# EAGLE design LIC_rack_CV-01 (EAGLE 7.2.0)
AUTHOR: M. Petrilak; VERSION: 00

## Sheet 1 of 3
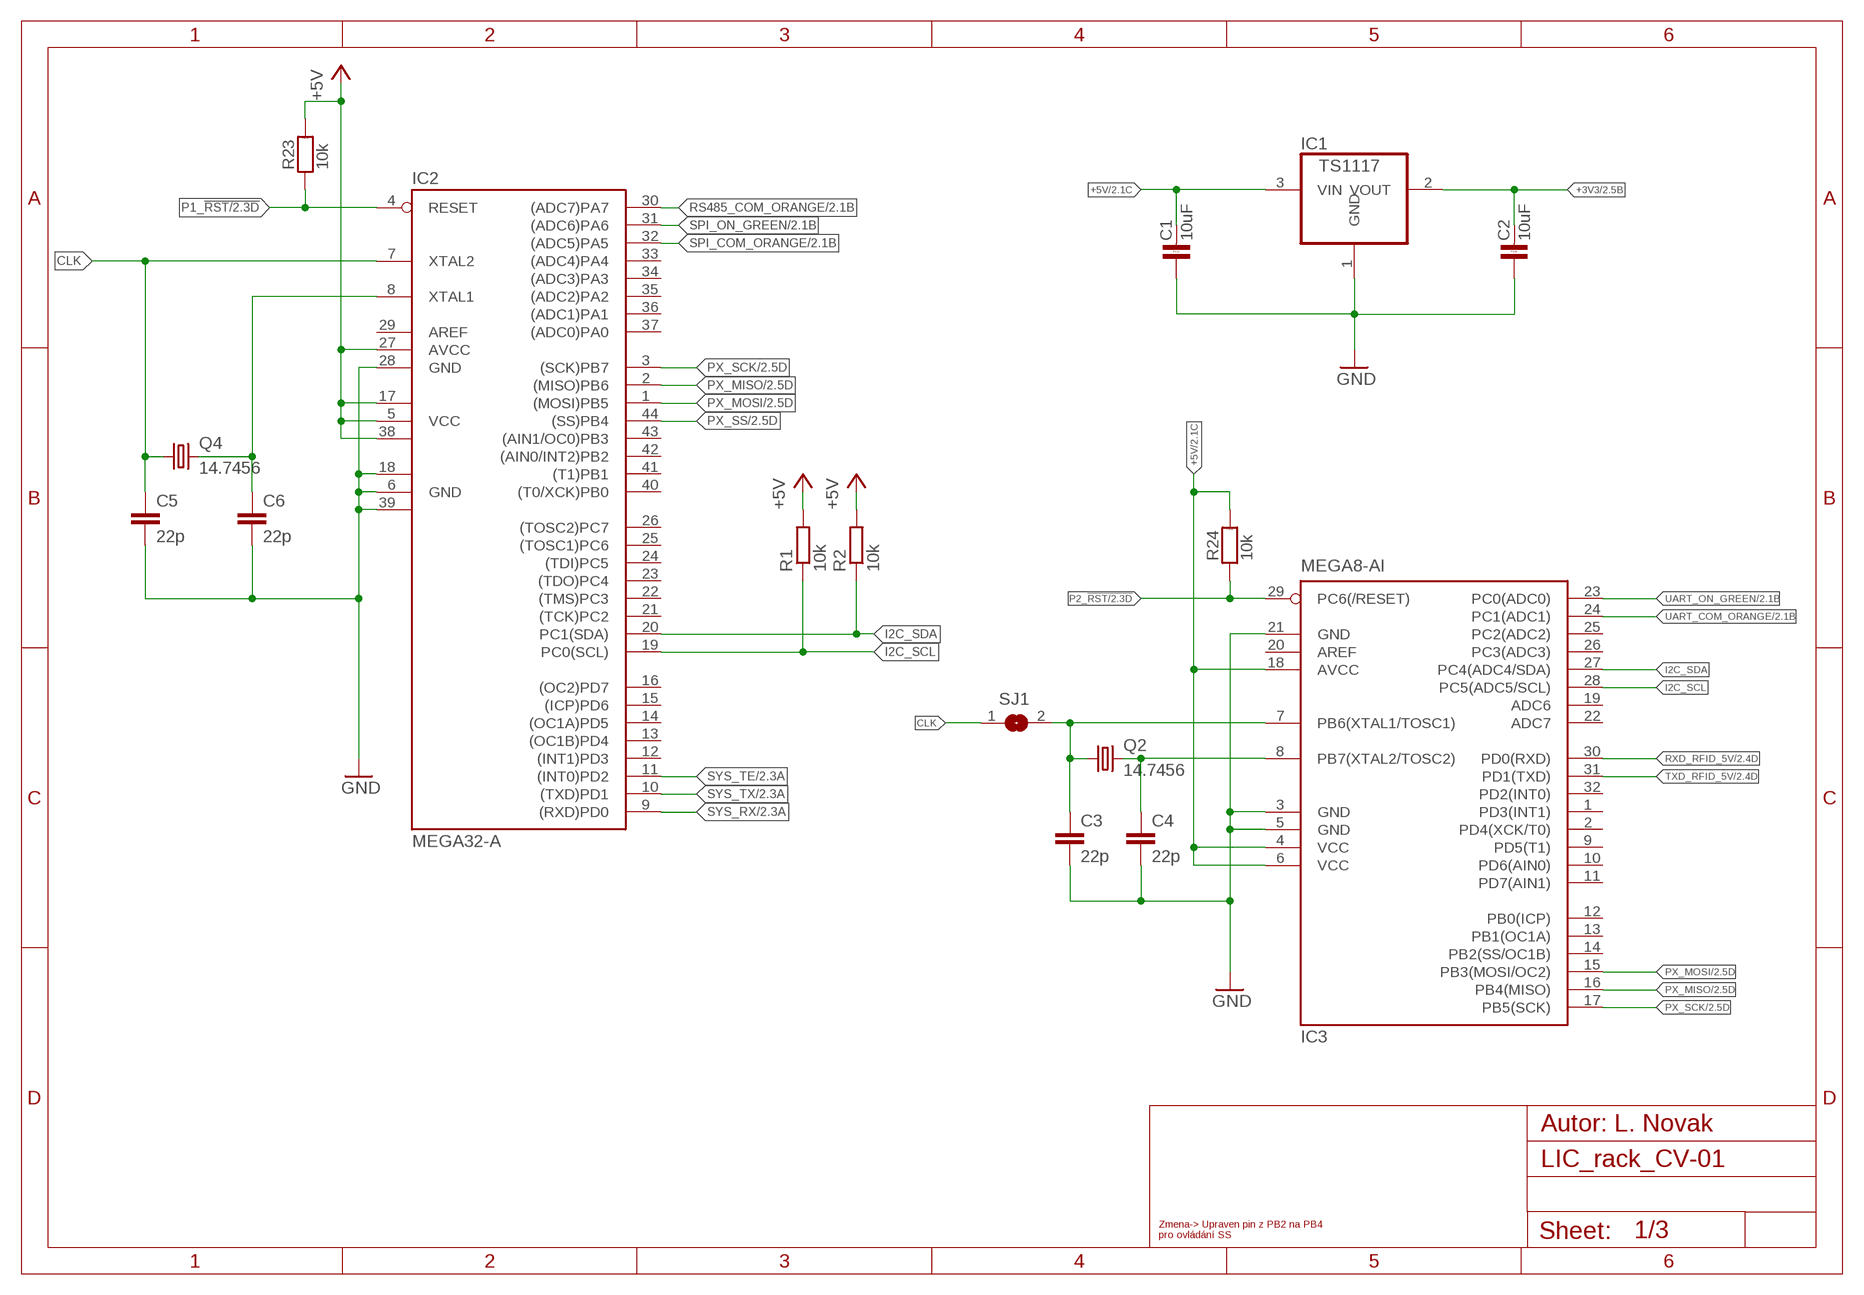
[diagram p0: schematic, sheet 1]

### Parts
C1  10uF  C-KER_1206  [1206]
C2  10uF  C-KER_1206  [1206]
C3  22p  C-EUC0805  [C0805]
C4  22p  C-EUC0805  [C0805]
C5  22p  C-EUC0805  [C0805]
C6  22p  C-EUC0805  [C0805]
IC1  TS1117  REG1117  [SOT223]
IC2  MEGA32-A  [TQFP44]
IC3  MEGA8-AI  [TQFP32-08]
Q2  14.7456  XTAL  [HC49U70]
Q4  14.7456  XTAL  [HC49U70]
R1  10k  R-EU_R1206  [R1206]
R2  10k  R-EU_R1206  [R1206]
R23  10k  R_1206  [1206]
R24  10k  R_1206  [1206]
SJ1  SJ  [SJ]

### Nets
+3V3: C2.2 IC1.2(VOUT) ; also sheet 2,3
+5V: C1.2 IC1.3(VIN) IC2.5(VCC) IC2.17(VCC1) IC2.27(AVCC) IC2.38(VCC2) IC3.4(VCC) IC3.6(VCC) IC3.18(AVCC) R1.2 R2.2 R23.2 R24.2 ; also sheet 2,3
CLK: C5.1 IC2.7(XTAL2) Q4.1 SJ1.1
CLK1: C3.1 IC3.7(PB6(XTAL1/TOSC1)) Q2.1 SJ1.2
GND: C1.1 C2.1 C3.2 C4.2 C5.2 C6.2 IC1.1(GND) IC2.6(GND) IC2.18(GND1) IC2.28(GND) IC2.39(GND2) IC3.3(GND) IC3.5(GND) IC3.21(GND) ; also sheet 2
I2C_SCL: IC2.19(PC0(SCL)) IC3.28(PC5(ADC5/SCL)) R1.1
I2C_SDA: IC2.20(PC1(SDA)) IC3.27(PC4(ADC4/SDA)) R2.1
N$3: C4.1 IC3.8(PB7(XTAL2/TOSC2)) Q2.2
N$19: C6.1 IC2.8(XTAL1) Q4.2
P1_!RST: IC2.4(RESET) R23.1 ; also sheet 2
P2_!RST: IC3.29(PC6(/RESET)) R24.1 ; also sheet 2
PX_MISO: IC2.2((MISO)PB6) IC3.16(PB4(MISO)) ; also sheet 2,3
PX_MOSI: IC2.1((MOSI)PB5) IC3.15(PB3(MOSI/OC2)) ; also sheet 2,3
PX_SCK: IC2.3((SCK)PB7) IC3.17(PB5(SCK)) ; also sheet 2,3
PX_SS: IC2.44((SS)PB4) ; also sheet 2,3
RS485_COM_ORANGE: IC2.30((ADC7)PA7) ; also sheet 2
RXD_RFID_5V: IC3.30(PD0(RXD)) ; also sheet 2,3
SPI_COM_ORANGE: IC2.32((ADC5)PA5) ; also sheet 2
SPI_ON_GREEN: IC2.31((ADC6)PA6) ; also sheet 2
SYS_RX: IC2.9((RXD)PD0) ; also sheet 2
SYS_TE: IC2.11((INT0)PD2) ; also sheet 2
SYS_TX: IC2.10((TXD)PD1) ; also sheet 2
TXD_RFID_5V: IC3.31(PD1(TXD)) ; also sheet 2,3
UART_COM_ORANGE: IC3.24(PC1(ADC1)) ; also sheet 2
UART_ON_GREEN: IC3.23(PC0(ADC0)) ; also sheet 2
Unconnected: IC2.12((INT1)PD3) IC2.13((OC1B)PD4) IC2.14((OC1A)PD5) IC2.15((ICP)PD6) IC2.16((OC2)PD7) IC2.21((TCK)PC2) IC2.22((TMS)PC3) IC2.23((TDO)PC4) IC2.24((TDI)PC5) IC2.25((TOSC1)PC6) IC2.26((TOSC2)PC7) IC2.29(AREF) IC2.33((ADC4)PA4) IC2.34((ADC3)PA3) IC2.35((ADC2)PA2) IC2.36((ADC1)PA1) IC2.37((ADC0)PA0) IC2.40((T0/XCK)PB0) IC2.41((T1)PB1) IC2.42((AIN0/INT2)PB2) IC2.43((AIN1/OC0)PB3) IC3.1(PD3(INT1)) IC3.2(PD4(XCK/T0)) IC3.9(PD5(T1)) IC3.10(PD6(AIN0)) IC3.11(PD7(AIN1)) IC3.12(PB0(ICP)) IC3.13(PB1(OC1A)) IC3.14(PB2(SS/OC1B)) IC3.19(ADC6) IC3.20(AREF) IC3.22(ADC7) IC3.25(PC2(ADC2)) IC3.26(PC3(ADC3)) IC3.32(PD2(INT0))

### Notes on the sheet
- Zmena-> Upraven pin z PB2 na PB4
  pro ovládání SS

## Sheet 2 of 3
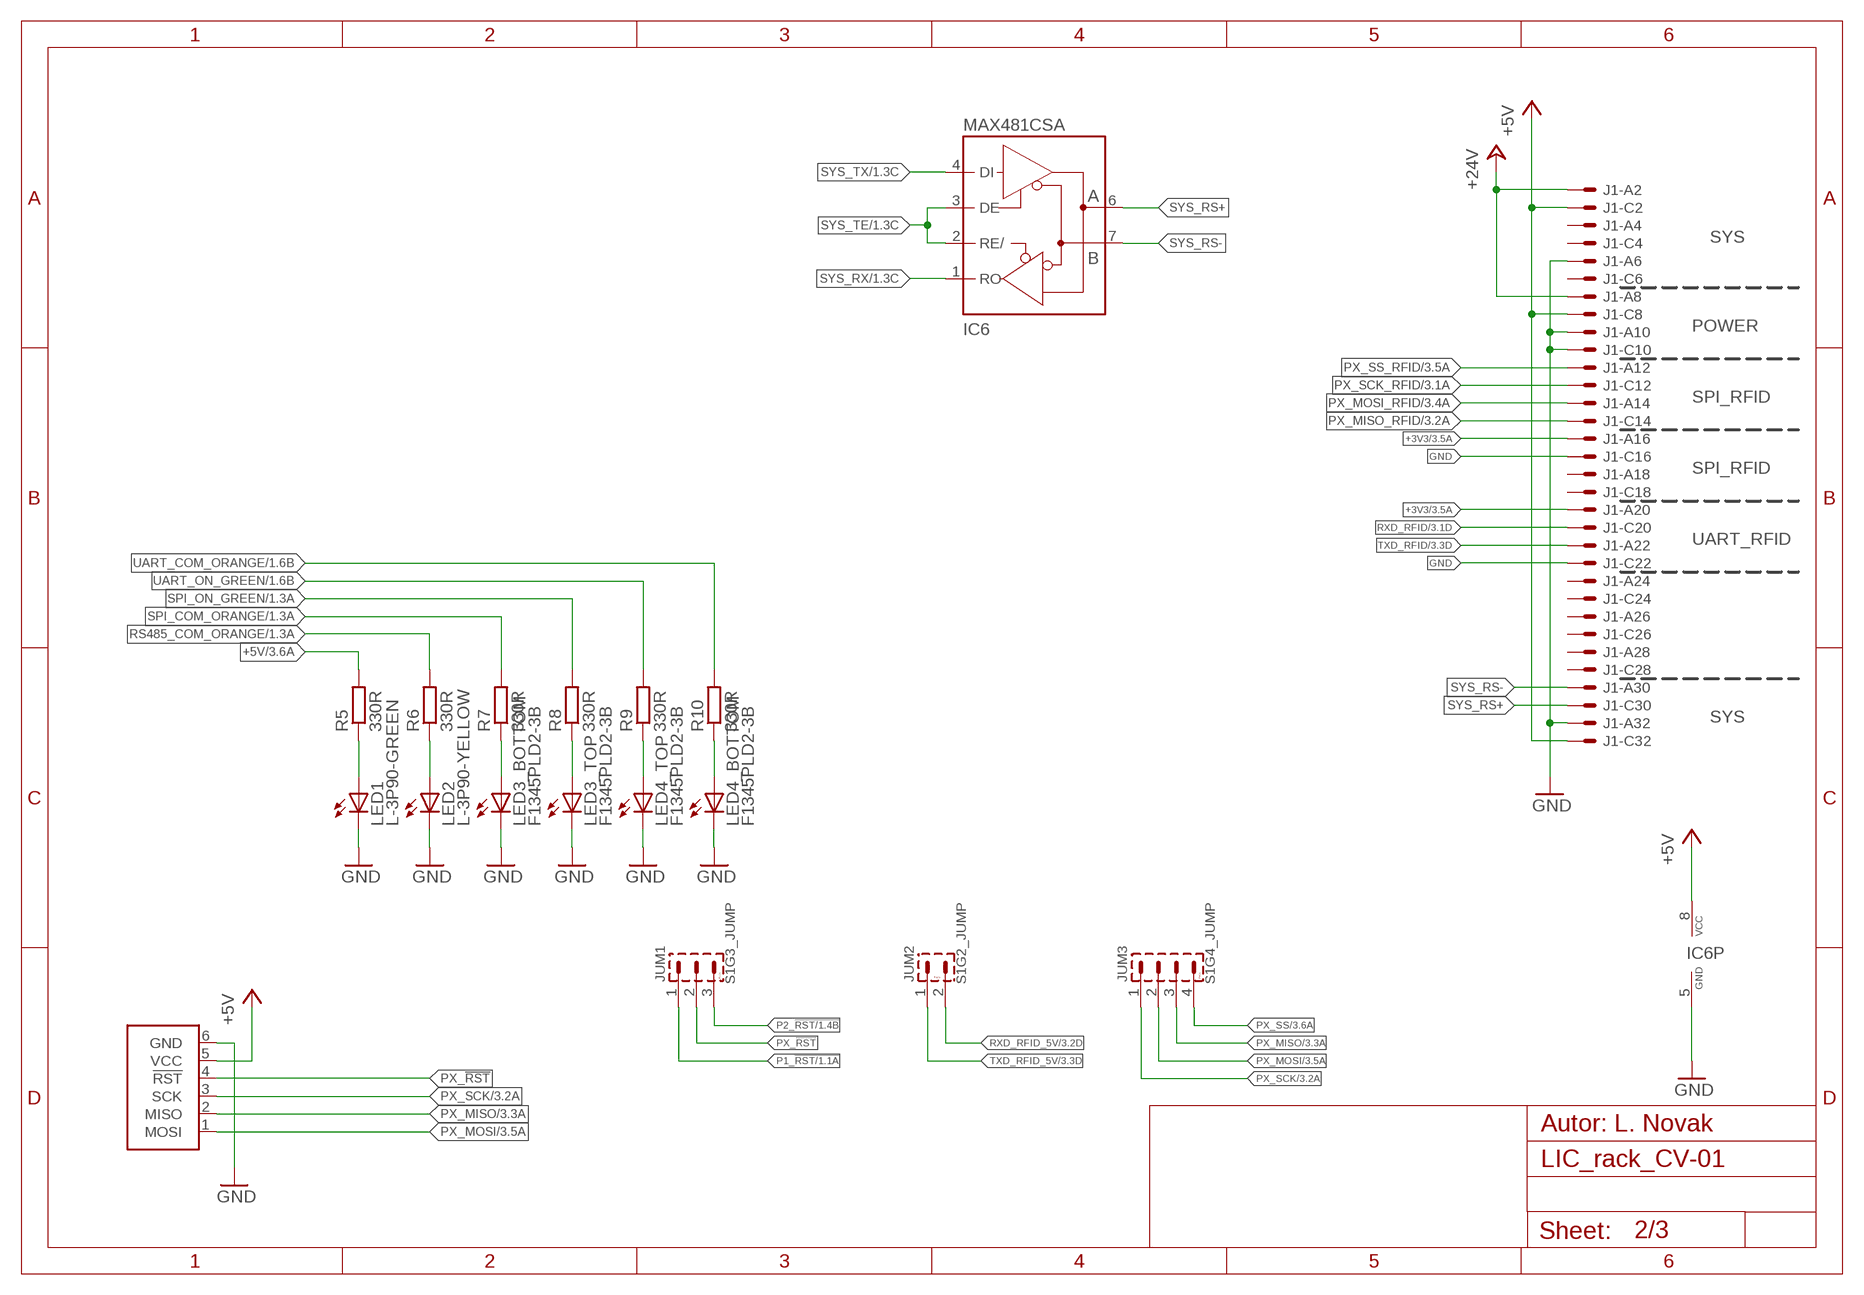
[diagram p1: schematic, sheet 2]

### Parts
IC6  MAX481CSA  [SO08]
J1  VG32SP  [VG32P]
JUM1  S1G3_JUMP  [S1G3_JUM]
JUM2  S1G2_JUMP  [S1G2_JUM]
JUM3  S1G4_JUMP  [S1G4_JUM]
LED1  L-3P90-GREEN  [L-3P90]
LED2  L-3P90-YELLOW  [L-3P90]
LED3  F1345PLD2-3B  [F1345PLD2-3B]
LED4  F1345PLD2-3B  [F1345PLD2-3B]
R5  330R  R-EU_R1206  [R1206]
R6  330R  R-EU_R1206  [R1206]
R7  330R  R-EU_R1206  [R1206]
R8  330R  R-EU_R1206  [R1206]
R9  330R  R-EU_R1206  [R1206]
R10  330R  R-EU_R1206  [R1206]
U1  ATPROG-V  [6410-06]

### Nets
+3V3: J1.A16 J1.A20 ; also sheet 1,3
+5V: IC6.8(VCC) J1.C2 J1.C8 J1.C32 R5.2 U1.5(VCC) ; also sheet 1,3
+24V: J1.A2 J1.A8
GND: IC6.5(GND) J1.A6 J1.A10 J1.A32 J1.C10 J1.C16 J1.C22 LED1.K(C) LED2.K(C) LED3.1K(C) LED3.2K(C) LED4.1K(C) LED4.2K(C) U1.6(GND) ; also sheet 1
N$1: LED2.A R6.1
N$2: LED1.A R5.1
N$9: LED4.1A(A) R10.1
N$10: LED4.2A(A) R9.1
N$11: LED3.2A(A) R8.1
N$12: LED3.1A(A) R7.1
P1_!RST: JUM1.1 ; also sheet 1
P2_!RST: JUM1.3 ; also sheet 1
PX_!RST: JUM1.2 U1.4(!RST)
PX_MISO: JUM3.3 U1.2(MISO) ; also sheet 1,3
PX_MISO_RFID: J1.C14 ; also sheet 3
PX_MOSI: JUM3.2 U1.1(MOSI) ; also sheet 1,3
PX_MOSI_RFID: J1.A14 ; also sheet 3
PX_SCK: JUM3.1 U1.3(SCK) ; also sheet 1,3
PX_SCK_RFID: J1.C12 ; also sheet 3
PX_SS: JUM3.4 ; also sheet 1,3
PX_SS_RFID: J1.A12 ; also sheet 3
RS485_COM_ORANGE: R6.2 ; also sheet 1
RXD_RFID: J1.C20 ; also sheet 3
RXD_RFID_5V: JUM2.2 ; also sheet 1,3
SPI_COM_ORANGE: R7.2 ; also sheet 1
SPI_ON_GREEN: R8.2 ; also sheet 1
SYS_RS+: IC6.6(A) J1.C30
SYS_RS-: IC6.7(B) J1.A30
SYS_RX: IC6.1(RO) ; also sheet 1
SYS_TE: IC6.2(RE/) IC6.3(DE) ; also sheet 1
SYS_TX: IC6.4(DI) ; also sheet 1
TXD_RFID: J1.A22 ; also sheet 3
TXD_RFID_5V: JUM2.1 ; also sheet 1,3
UART_COM_ORANGE: R10.2 ; also sheet 1
UART_ON_GREEN: R9.2 ; also sheet 1
Unconnected: J1.A4 J1.A18 J1.A24 J1.A26 J1.A28 J1.C4 J1.C6 J1.C18 J1.C24 J1.C26 J1.C28

### Notes on the sheet
- SYS
- POWER
- SPI_RFID
- SPI_RFID
- UART_RFID
- SYS

## Sheet 3 of 3
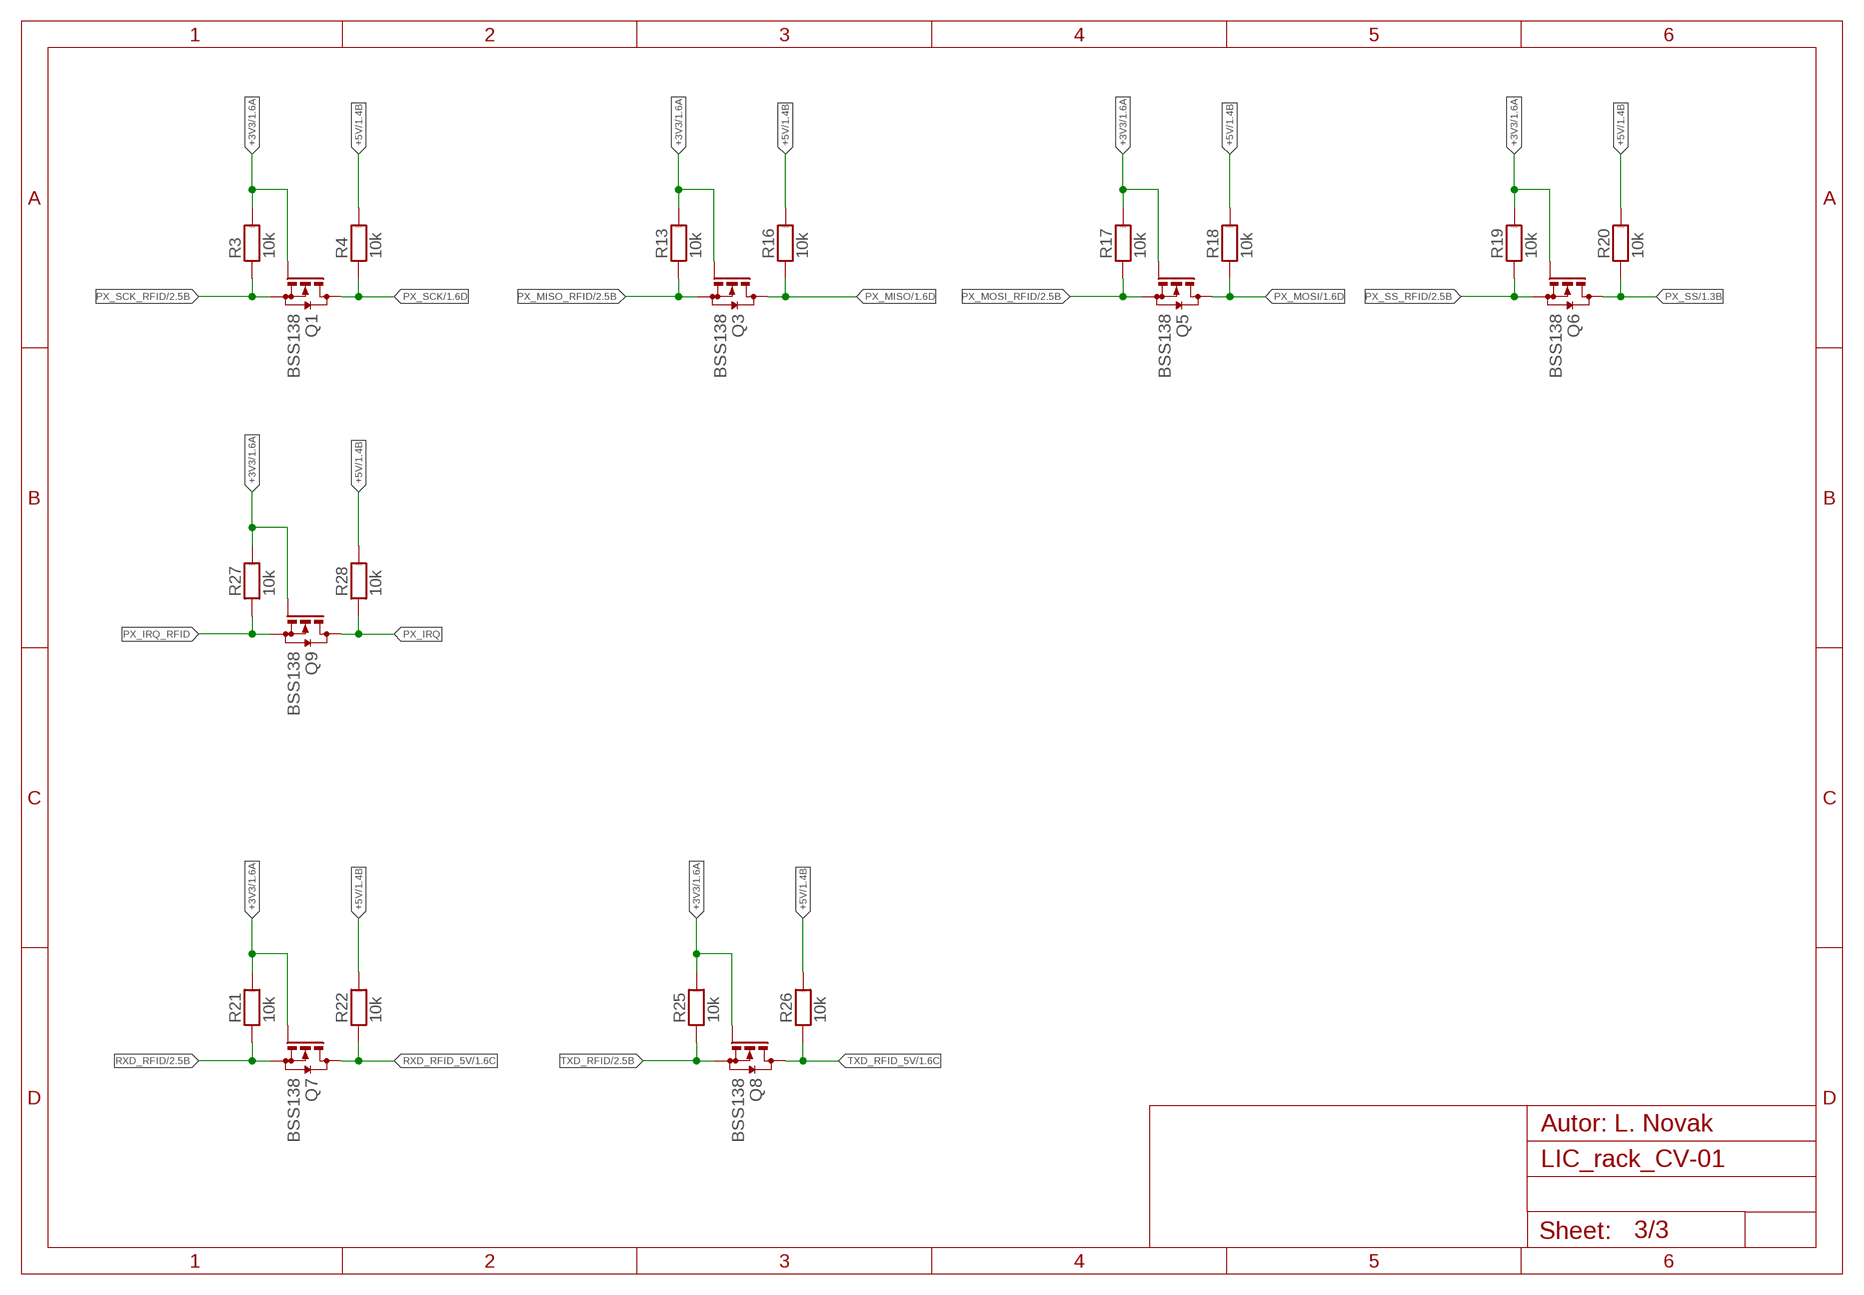
[diagram p2: schematic, sheet 3]

### Parts
Q1  BSS138  BSS123  [SOT23]
Q3  BSS138  BSS123  [SOT23]
Q5  BSS138  BSS123  [SOT23]
Q6  BSS138  BSS123  [SOT23]
Q7  BSS138  BSS123  [SOT23]
Q8  BSS138  BSS123  [SOT23]
Q9  BSS138  BSS123  [SOT23]
R3  10k  R_1206  [1206]
R4  10k  R_1206  [1206]
R13  10k  R_1206  [1206]
R16  10k  R_1206  [1206]
R17  10k  R_1206  [1206]
R18  10k  R_1206  [1206]
R19  10k  R_1206  [1206]
R20  10k  R_1206  [1206]
R21  10k  R_1206  [1206]
R22  10k  R_1206  [1206]
R25  10k  R_1206  [1206]
R26  10k  R_1206  [1206]
R27  10k  R_1206  [1206]
R28  10k  R_1206  [1206]

### Nets
+3V3: Q1.1(G) Q3.1(G) Q5.1(G) Q6.1(G) Q7.1(G) Q8.1(G) Q9.1(G) R3.2 R13.2 R17.2 R19.2 R21.2 R25.2 R27.2 ; also sheet 1,2
+5V: R4.2 R16.2 R18.2 R20.2 R22.2 R26.2 R28.2 ; also sheet 1,2
PX_IRQ: Q9.3(D) R28.1
PX_IRQ_RFID: Q9.2(S) R27.1
PX_MISO: Q3.3(D) R16.1 ; also sheet 1,2
PX_MISO_RFID: Q3.2(S) R13.1 ; also sheet 2
PX_MOSI: Q5.3(D) R18.1 ; also sheet 1,2
PX_MOSI_RFID: Q5.2(S) R17.1 ; also sheet 2
PX_SCK: Q1.3(D) R4.1 ; also sheet 1,2
PX_SCK_RFID: Q1.2(S) R3.1 ; also sheet 2
PX_SS: Q6.3(D) R20.1 ; also sheet 1,2
PX_SS_RFID: Q6.2(S) R19.1 ; also sheet 2
RXD_RFID: Q7.2(S) R21.1 ; also sheet 2
RXD_RFID_5V: Q7.3(D) R22.1 ; also sheet 1,2
TXD_RFID: Q8.2(S) R25.1 ; also sheet 2
TXD_RFID_5V: Q8.3(D) R26.1 ; also sheet 1,2

## Library data of the parts
C1 C2 = #PaJa_31:C-KER: Kondenzator - keramicky
C3-C6 = rcl:C-EU: CAPACITOR, European symbol
IC1 = burr-brown:REG1117: 800mA and 1A Low Dropout (LDO) Positive Regulator 1.8V, 2.5V, 2.85V, 3.3V, 5V, and Adj; MPN: REG1117; OC_FARNELL: 1097566; OC_NEWARK: 14P6981
IC2 = atmel:MEGA32: MICROCONTROLLER 32 Kbytes FLASH 2 Kbytes SRAM 1 Kbytes EEPROM USART 8-channel 10 bit ADC Source: www.atmel.com .. doc2503.pdf; MPN: ATMEGA32-16AU; OC_FARNELL: 9171274; OC_NEWARK: 69K6677
IC3 = atmel:MEGA8: MICROCONTROLLER 8 Kbytes FLASH, 1 kbytes SRAM, 512 bytes EEPROM, USART, 6-channel 10 bit ADC, 2-channel 8 bit ADC Pin compatible with Atmega48, ATMega88, ATMega168 Source: avr.lbr; MPN: ATMEGA8-16AU; OC_FARNELL: 9171371; OC_NEWARK: 73M8863
IC6 = maxim:MAX481CSA: RS485 TRANSEIVER
J1 = 19inch:VG32S: PCB EUROCARD, 32-pin type C/AC, 5.08 mm
JUM1 = #PaJa_konektory:S1G3_JUMP: Radove konektory - koliky - 3x
JUM2 = #PaJa_konektory:S1G2_JUMP: Radove konektory - koliky - 2x
JUM3 = #PaJa_konektory:S1G4_JUMP: Radove konektory - koliky - 4x
LED1 LED2 = led:L-3P90
LED3 LED4 = led:F1345PLD2-3B
Q1 Q3 Q5-Q9 = transistor-small-signal:BSS123: N-CHANNEL MOS FET
Q2 Q4 = crystal:XTAL
R1 R2 R5-R10 = rcl:R-EU_: RESISTOR, European symbol
R3 R4 R13 R16-R28 = #PaJa_31:R: Rezistor
SJ1 = jumper:SJ: SMD solder JUMPER
U1 = con-molex:ATPROG

## Board
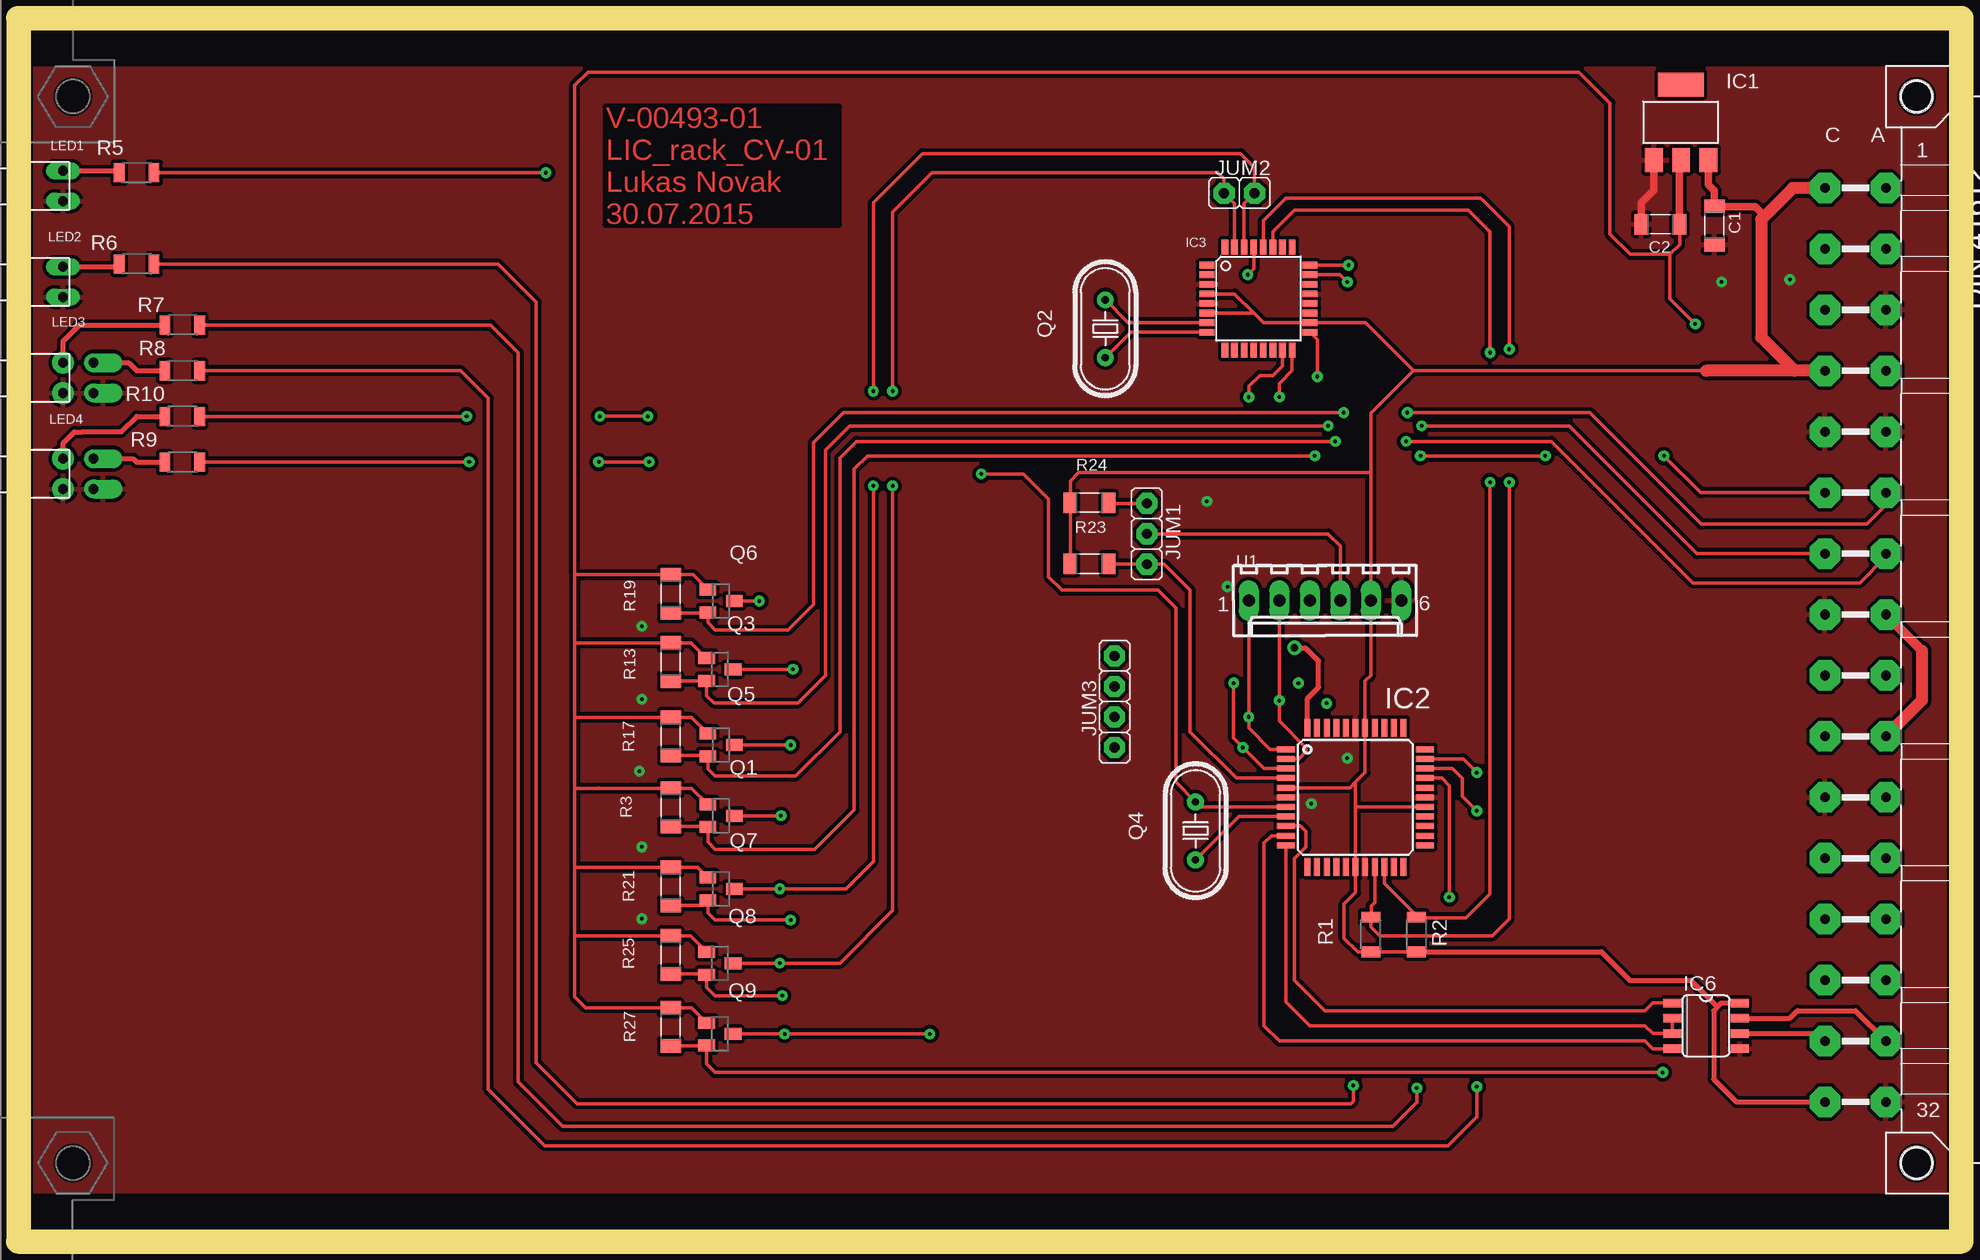
[diagram p3: board, top side]
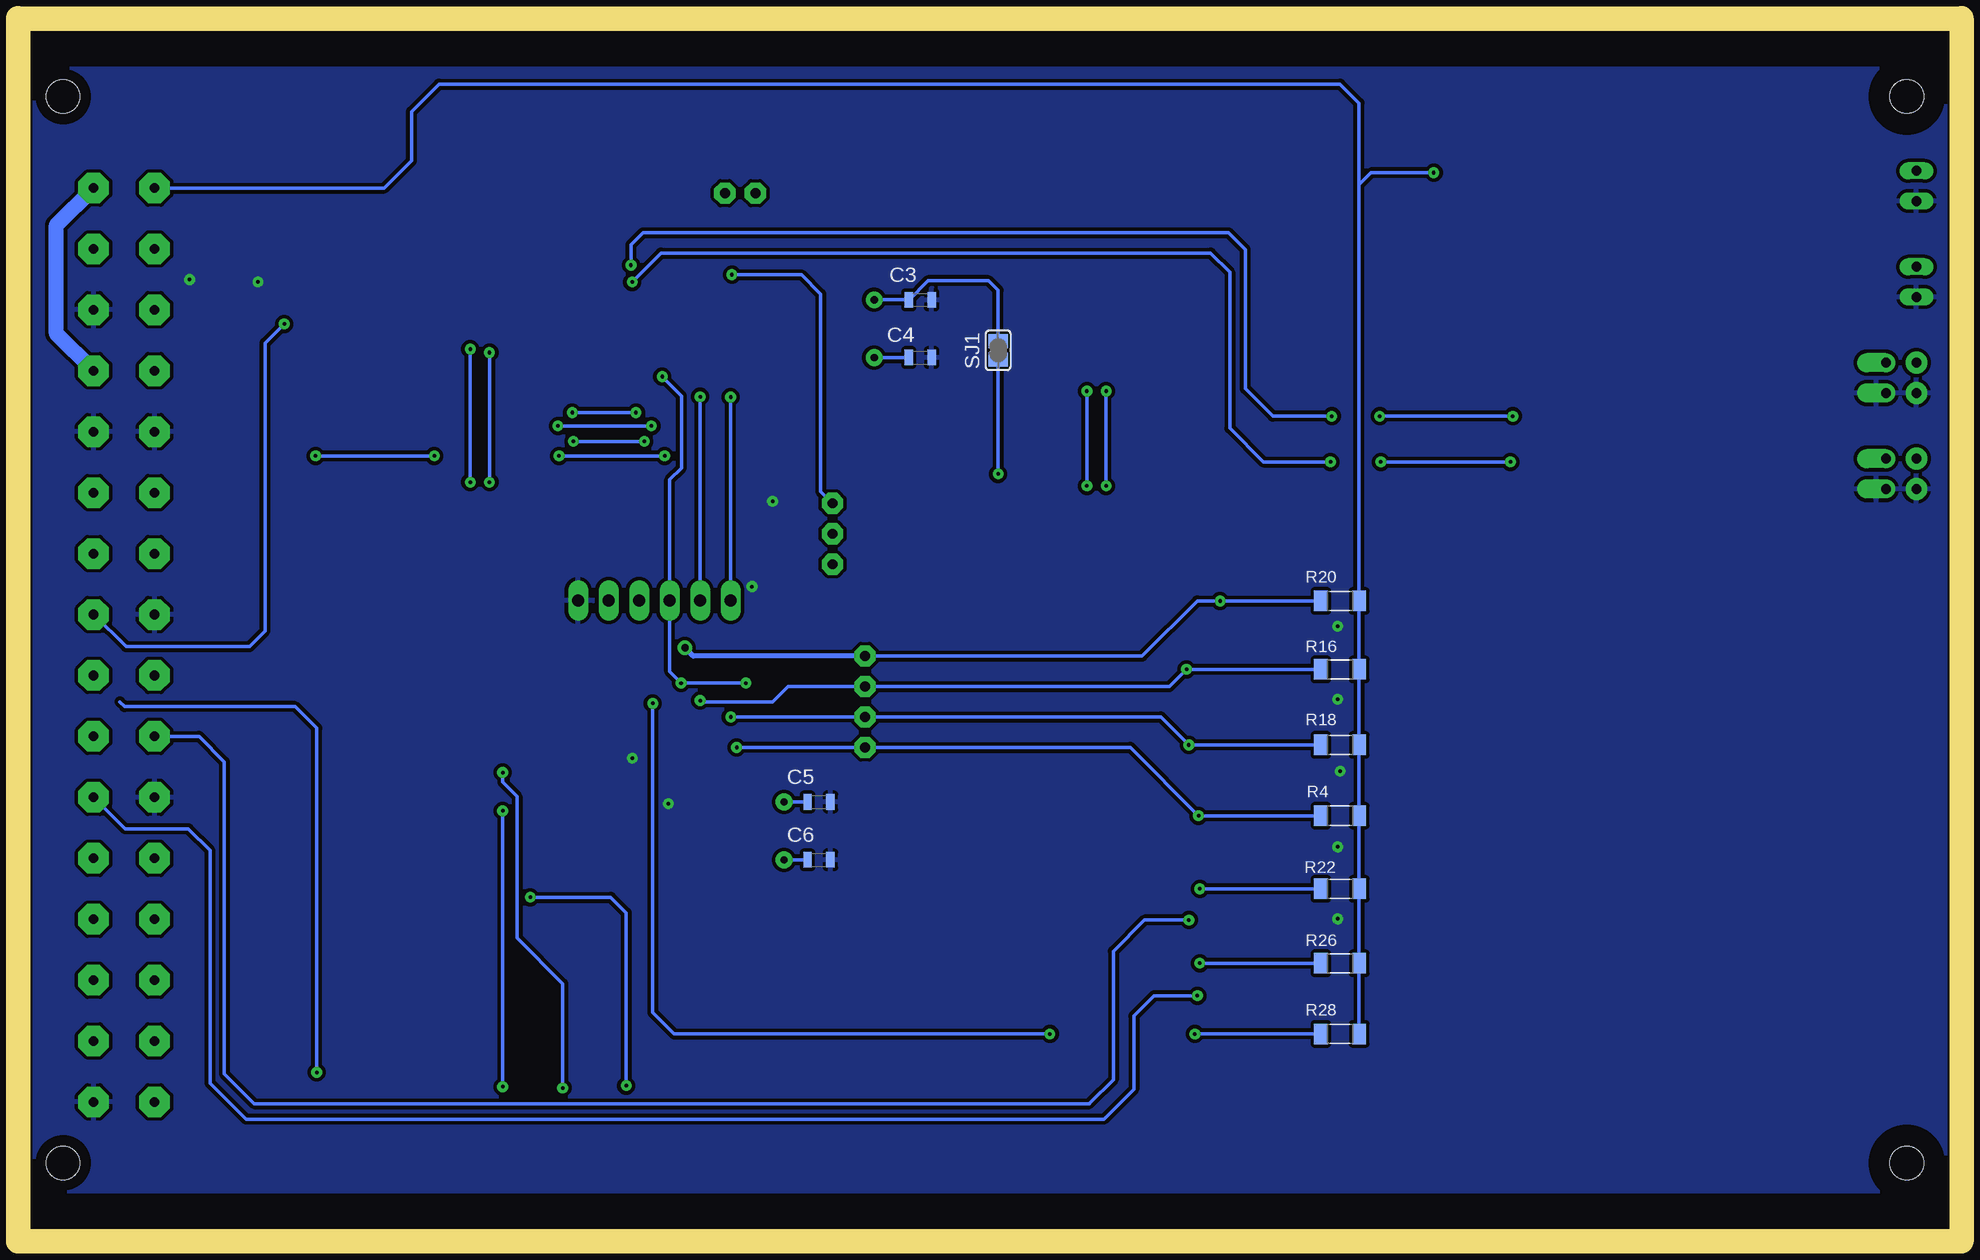
[diagram p4: board, bottom side, seen from below]

Size 160 x 100 mm. Coordinates in mm from the lower left corner, seen from the top.
Copper layers (1*16): Top 0.04mm / dielectric 1.5mm / Bottom 0.04mm
Design rules "mucha_navrh_my_fine *": minimum track width 0.2mm, minimum drill 0.3mm, track to track 0.3mm, track to pad 0.3mm, pad to pad 0.3mm, via to via 0.3mm, smd to smd 0mil, copper to edge 0.2mm, drill to drill 0.2mm, minimum pad ring 0.3mm, minimum via ring 0.3mm, stop-mask expansion 0.1mm, vias tented up to drill 0.5mm, thermal gap 0.3mm

### Footprints (pad centres in the part's own frame; a part is rotated, then mirrored left to right if it is on the bottom)
1206 = smd 1.143 x 1.702: 1 -1.587,0; 2 1.587,0
C0805 = smd 0.7 x 1.3: 1 -0.95,0; 2 0.95,0
SOT223 = smd 1.499 x 2.007: 1 -2.261,-3.15; 2 0.025,-3.15; 3 2.311,-3.15 | smd 3.81 x 2.007: 4 0,3.15
TQFP44 = smd 1.5 x 0.5: 1 -5.8,4; 2 -5.8,3.2; 3 -5.8,2.4; 4 -5.8,1.6; 5 -5.8,0.8; 6 -5.8,0; 7 -5.8,-0.8; 8 -5.8,-1.6; 9 -5.8,-2.4; 10 -5.8,-3.2; 11 -5.8,-4; 23 5.8,-4; 24 5.8,-3.2; 25 5.8,-2.4; 26 5.8,-1.6; 27 5.8,-0.8; 28 5.8,0; 29 5.8,0.8; 30 5.8,1.6; 31 5.8,2.4; 32 5.8,3.2; 33 5.8,4 | smd 0.5 x 1.5: 12 -4,-5.8; 13 -3.2,-5.8; 14 -2.4,-5.8; 15 -1.6,-5.8; 16 -0.8,-5.8; 17 0,-5.8; 18 0.8,-5.8; 19 1.6,-5.8; 20 2.4,-5.8; 21 3.2,-5.8; 22 4,-5.8; 34 4,5.8; 35 3.2,5.8; 36 2.4,5.8; 37 1.6,5.8; 38 0.8,5.8; 39 0,5.8; 40 -0.8,5.8; 41 -1.6,5.8; 42 -2.4,5.8; 43 -3.2,5.8; 44 -4,5.8
TQFP32-08 = smd 1.27 x 0.559: 1 -4.293,2.8; 2 -4.293,2; 3 -4.293,1.2; 4 -4.293,0.4; 5 -4.293,-0.4; 6 -4.293,-1.2; 7 -4.293,-2; 8 -4.293,-2.8; 17 4.293,-2.8; 18 4.293,-2; 19 4.293,-1.2; 20 4.293,-0.4; 21 4.293,0.4; 22 4.293,1.2; 23 4.293,2; 24 4.293,2.8 | smd 0.559 x 1.27: 9 -2.8,-4.293; 10 -2,-4.293; 11 -1.2,-4.293; 12 -0.4,-4.293; 13 0.4,-4.293; 14 1.2,-4.293; 15 2,-4.293; 16 2.8,-4.293; 25 2.8,4.293; 26 2,4.293; 27 1.2,4.293; 28 0.4,4.293; 29 -0.4,4.293; 30 -1.2,4.293; 31 -2,4.293; 32 -2.8,4.293
SO08 = smd 0.72 x 1.5: 1 -1.905,-2.8; 2 -0.635,-2.8; 3 0.635,-2.8; 4 1.905,-2.8; 5 1.905,2.8; 6 0.635,2.8; 7 -0.635,2.8; 8 -1.905,2.8
VG32P = drill 0.8 pad 2.54 octagon: A2 154.7,36.83; A4 154.7,31.75; A6 154.7,26.67; A8 154.7,21.59; A10 154.7,16.51; A12 154.7,11.43; A14 154.7,6.35; A16 154.7,1.27; A18 154.7,-3.81; A20 154.7,-8.89; A22 154.7,-13.97; A24 154.7,-19.05; A26 154.7,-24.13; A28 154.7,-29.21; A30 154.7,-34.29; A32 154.7,-39.37; C2 149.62,36.83; C4 149.62,31.75; C6 149.62,26.67; C8 149.62,21.59; C10 149.62,16.51; C12 149.62,11.43; C14 149.62,6.35; C16 149.62,1.27; C18 149.62,-3.81; C20 149.62,-8.89; C22 149.62,-13.97; C24 149.62,-19.05; C26 149.62,-24.13; C28 149.62,-29.21; C30 149.62,-34.29; C32 149.62,-39.37 | hole 2.794: 3.57,44.45; 3.57,-44.45; 157.24,44.45; 157.24,-44.45; 3.57,44.45; 3.57,-44.45; 157.24,44.45; 157.24,-44.45
S1G3_JUM = drill 0.813 pad 1.778 octagon: 1 -2.54,0; 2 0,0; 3 2.54,0
S1G2_JUM = drill 0.813 pad 1.778 octagon: 1 -1.27,0; 2 1.27,0
S1G4_JUM = drill 0.813 pad 1.778 octagon: 1 -3.81,0; 2 -1.27,0; 3 1.27,0; 4 3.81,0
L-3P90 = drill 0.813 long: A 4.7,1.27; K 4.7,-1.27
F1345PLD2-3B = drill 0.8 pad 1.8: 1A 4.7,1.27; 1K 4.7,-1.27 | drill 0.8 pad 1.6 offset: 2A 7.24,1.27; 2K 7.24,-1.27
SOT23 = smd 1 x 1.4: 1 -0.95,-1.1; 2 0.95,-1.1; 3 0,1.1
HC49U70 = drill 0.6 pad 1.4: 1 -2.413,0; 2 2.413,0
R1206 = smd 0.9 x 1.6: 1 -1.45,0; 2 1.45,0
SJ = smd 1.168 x 1.6: 1 -0.762,0; 2 0.762,0
6410-06 = drill 1.016 long: 1 6.35,0; 2 3.81,0; 3 1.27,0; 4 -1.27,0; 5 -3.81,0; 6 -6.35,0

### Placement (x,y rotation side)
C1  140.4,83.7 90 top
C2  135.9,83.8 0 top
C3  85.8,77.5 0 bottom
C4  85.8,72.7 0 bottom
C5  94.23,35.65 0 bottom
C6  94.23,30.82 0 bottom
IC1  137.6,92.3 0 top
IC2  110.49,36.03 0 top
IC3  102.4,77.6 0 top
IC6  139.7,16.98 270 top
J1  0,50 0 top
JUM1  93.1,58 90 top
JUM2  100.8,86.4 0 top
JUM3  90.4,44 90 top
LED1  -1.94,87 0 top
LED2  -1.94,79 0 top
LED3  -1.94,71 0 top
LED4  -1.94,63 0 top
Q1  57.6,34.5 270 top
Q2  89.63,75.09 270 top
Q3  57.5,46.7 270 top
Q4  97.16,33.24 270 top
Q5  57.6,40.4 270 top
Q6  57.6,52.4 270 top
Q7  57.6,28.4 270 top
Q8  57.5,22.2 270 top
Q9  57.5,16.3 270 top
R1  111.76,24.6 270 top
R2  115.57,24.6 270 top
R3  53.4,35.2 90 top
R4  50.8,34.5 0 bottom
R5  8.89,88.1 0 top
R6  8.89,80.48 0 top
R7  12.7,75.4 0 top
R8  12.7,71.59 0 top
R9  12.7,63.97 0 top
R10  12.7,67.78 0 top
R13  53.4,47.3 90 top
R16  50.8,46.7 0 bottom
R17  53.4,41.1 90 top
R18  50.8,40.4 0 bottom
R19  53.4,53 90 top
R20  50.8,52.4 0 bottom
R21  53.4,28.6 90 top
R22  50.8,28.4 0 bottom
R23  88.3,55.5 180 top
R24  88.3,60.6 180 top
R25  53.4,22.9 90 top
R26  50.8,22.2 0 bottom
R27  53.4,16.9 90 top
R28  50.8,16.3 0 bottom
SJ1  79.3,73.3 90 bottom
U1  107.95,52.43 180 top

### Tracks (layer width: path | path; a pad name or v marks a point on that pad's centre or on a via)
+3V3  (via drill 0.3)
  Top 0.305: 137.49,89.01 IC1.2 | Q6.1 55.26,54.59 R19.2 53.39,54.6 45.4,54.6 | Q3.1 56.35,47.65 55.1,48.9 53.41,48.9 R13.2 45.41,48.89 45.4,48.9 | 45.4,54.6 45.4,48.9 | 45.4,48.9 45.4,42.8 | Q5.1 55.16,42.69 R17.2 45.51,42.69 45.4,42.8 | Q1.1 55.16,36.79 R3.2 47.41,36.79 | 47.41,36.79 47.4,36.8 | 45.4,42.8 45.4,36.7 | 47.41,36.79 45.49,36.79 45.4,36.7 | 45.4,36.7 45.4,30.1 | 45.4,30.1 45.4,24.5 | 45.4,24.5 45.41,24.49 R25.2 55.06,24.49 Q8.1 | 45.4,30.1 45.49,30.19 R21.2 55.66,30.19 Q7.1 | Q9.1 55.16,18.49 R27.2 46.31,18.49 45.4,19.4 45.4,24.5 | 45.4,54.6 45.4,95.4 46.5,96.5 129.1,96.5 131.7,93.9 131.7,83 133.4,81.3 136.7,81.3 | 136.7,81.3 137.5,82.1 137.5,83.79 C2.2 | 136.7,81.3 136.7,77.6 v138.8,75.5
  Top 0.61: 137.49,89.01 C2.2
  Top 0.813: 157.7,48.27 J1.A16
  Top 1.016: J1.A20 157.7,44.11 157.7,48.27
  Bottom 0.305: v138.8,75.5 140.4,73.9 140.4,49.9 141.7,48.6 152,48.6 154.67,51.27 J1.A16
+5V  (via drill 0.3)
  Top 0.305: IC2.5 110.02,36.83 110.49,37.3 | 110.49,37.3 111.29,38.1 IC2.38 111.29,45.72 111.76,46.19 U1.5 111.76,63.2 | IC2.27 110.66,35.23 110.49,35.39 | 110.49,35.39 110.49,37.3 | 110.49,35.39 IC2.17 110.49,28.09 109.54,27.14 109.54,24.28 110.67,23.15 R1.2 R2.2 | 111.76,63.2 111.76,68.06 115.3,71.6 | 139.72,71.6 115.3,71.6 | R5.2 v43,88.1 | IC3.6 102,76.4 | 102,76.4 102.8,75.6 IC3.18 111.3,75.6 115.3,71.6 | IC3.4 100.4,78 102,76.4 | R23.2 R24.2 86.71,62.41 87.4,63.1 111.66,63.1 111.76,63.2
  Top 0.406: J1.C32 142.24,10.63 140.34,12.53 140.34,18.25 140.65,18.57 | 140.65,18.57 140.97,18.89 IC6.8 | R2.2 130.99,23.15 133.35,20.79 138.43,20.79 140.65,18.57
  Top 0.61: IC1.3 139.91,87.09 140.4,86.6 C1.2 143.81,85.29 144.6,84.5
  Top 1.016: J1.C8 147.1,71.59 | 147.1,71.59 139.73,71.59 139.72,71.6 | J1.C2 146.93,86.83 144.6,84.5 144.3,84.2 144.3,74.39 147.1,71.59
  Bottom 0.305: R28.2 R26.2 R22.2 R4.2 R18.2 R16.2 R20.2 49.21,87.1 | J1.C2 130.47,86.83 128.2,89.1 128.2,93.2 125.9,95.5 50.8,95.5 49.21,93.91 49.21,87.1 | v43,88.1 48.21,88.1 49.21,87.1
+24V
  Bottom 1.27: J1.A2 157.8,83.73 157.8,74.69 J1.A8
CLK  (via drill 0.3)
  Top 0.305: IC2.7 97.57,35.23 Q4.1 95.5,37.3 95.5,51.8 94,53.3 86,53.3 84.9,54.4 84.9,60.9 82.8,63 v79.3,63
  Bottom 0.305: 97.16,35.78 Q4.1 C5.1 | SJ1.1 v79.3,63
CLK1
  Top 0.305: IC3.7 91.53,75.6 Q2.1
  Bottom 0.305: Q2.1 C3.1 85.15,79.1 80.1,79.1 79.3,78.3 SJ1.2
GND  (via drill 0.3)
  Top 0.305: 134.3,83.81 C2.1
  Top 0.61: 134.3,83.81 134.3,85.6 135.34,86.64 IC1.1
  other vias: 99.82,53.6 146.7,79.2 141,79 51,50.3 51,25.9 51,31.9 50.8,38.2 51,44.2 106.8,35.5 109.8,39.3 98.1,60.7
  pour Bottom: 0,-0.8 160.02,-0.8 160.02,99.53 0,99.53
  pour Top: 0,0.47 160.02,0.47 160.02,99.53 0,99.53
I2C_SCL  (via drill 0.3)
  Top 0.305: IC2.19 112.09,27.29 111.8,27 111.8,26.09 R1.1 111.76,25.24 112.5,24.5 121.9,24.5 123.3,25.9 v123.3,62.3 | v123.3,73.4 123.3,83.6 121.1,85.8 120.9,86 104.7,86 102.8,84.1 IC3.28
  Bottom 0.305: v123.3,62.3 v123.3,73.4
I2C_SDA  (via drill 0.3)
  Top 0.305: IC2.20 112.89,28.87 115.57,26.19 R2.1 115.62,26 119.7,26 121.7,28 v121.7,62.3 | IC3.27 103.6,83.2 105.4,85 119.9,85 121.7,83.2 v121.7,73.1
  Bottom 0.305: v121.7,73.1 v121.7,62.3
N$1
  Top 0.406: LED2.A 7.23,80.27 R6.1
N$2
  Top 0.406: LED1.A 7.27,88.27 R5.1
N$3
  Top 0.305: IC3.8 91.75,74.8 Q2.2
  Bottom 0.305: Q2.2 86.77,72.68 C4.1
N$9
  Top 0.406: R10.1 8.89,67.78 7.62,66.51 4.4,66.51 4.39,66.5 3.7,66.5 2.76,65.56 LED4.1A
N$10
  Top 0.406: LED4.2A 8.59,64.27 8.89,63.97 R9.1
N$11
  Top 0.406: LED3.2A 8.21,72.27 8.89,71.59 R8.1
N$12
  Top 0.406: R7.1 4.1,75.4 2.76,74.06 LED3.1A
N$19
  Top 0.305: IC2.8 100.76,34.43 Q4.2
  Bottom 0.305: C6.1 Q4.2
P1_!RST
  Top 0.305: IC2.4 100.57,37.63 96.7,41.5 96.7,53.3 94.54,55.46 JUM1.1 89.93,55.46 R23.1
P2_!RST  (via drill 0.3)
  Top 0.305: JUM1.3 89.95,60.54 R24.1 | IC3.29 102,80.1 v101.5,79.6
  Bottom 0.305: v101.5,79.6 95.7,79.6 94.1,78 94.1,61.54 JUM1.3
PX_!RST
  Top 0.305: JUM1.2 108.2,58 109.22,56.98 U1.4
PX_IRQ  (via drill 0.3)
  Top 0.305: Q9.3 v62.9,16.3 v75,16.3
  Bottom 0.305: R28.1 v62.9,16.3 | v108.09,43.86 108.09,18.09 106.3,16.3 v75,16.3
PX_IRQ_RFID  (via drill 0.3)
  Top 0.305: R27.1 56.36,15.31 Q9.2 56.4,13.8 57.1,13.1 v136.1,13.1
  Bottom 0.305: v136.1,13.1 136.1,41.8 137.9,43.6 152.11,43.6 152.5,43.99
PX_MISO  (via drill 0.3)
  Top 0.305: IC2.2 105.75,39.23 106.36,39.84 106.36,40.16 104.14,42.38 v104.14,44.1 U1.2 | v63.6,46.7 Q3.3 | v104.14,69.42 104.14,70.54 105.2,71.6 IC3.16
  Bottom 0.305: v104.14,44.1 104.04,44 98.1,44 96.83,45.27 JUM3.3 65.03,45.27 v63.6,46.7 R16.1 | U1.2 v104.14,69.42
PX_MISO_RFID  (via drill 0.3)
  Top 0.305: R13.1 56.36,45.71 Q3.2 56.4,44.5 57,43.9 64,43.9 66.3,46.2 66.3,65 68.3,67 v108.2,67 | J1.C14 138.95,56.35 128.3,67 v116,67
  Bottom 0.305: v108.2,67 v116,67
PX_MOSI  (via drill 0.3)
  Top 0.305: IC2.1 103.37,40.03 101.6,41.8 v101.6,42.72 v101.59,42.73 101.59,48.72 U1.1 | Q5.3 v63.4,40.4 | v101.6,69.4 101.6,70.3 102.5,71.2 103.6,71.2 104.4,72 IC3.15
  Bottom 0.305: v101.59,42.73 JUM3.2 65.73,42.73 v63.4,40.4 R18.1 | U1.1 v101.6,69.4
PX_MOSI_RFID  (via drill 0.3)
  Top 0.305: R17.1 56.44,39.51 Q5.2 56.5,38.4 57.1,37.8 63.8,37.8 67.5,41.5 67.5,64.3 68.9,65.7 v108.8,65.7 | J1.A14 154.7,56.1 152.5,53.9 138.6,53.9 126.8,65.7 v114.7,65.7
  Bottom 0.305: v108.8,65.7 v114.7,65.7
PX_SCK  (via drill 0.3)
  Top 0.305: IC2.3 102.86,38.43 v101.1,40.19 100.33,40.96 v100.33,45.55 | v62.6,34.5 Q1.3 | v107.3,71.1 107.3,74.19 IC3.17
  Bottom 0.305: v100.33,45.55 v105.73,45.55 106.68,46.51 U1.3 106.68,62.52 105.7,63.5 105.7,69.5 v107.3,71.1 | v101.1,40.19 JUM3.1 68.29,40.19 v62.6,34.5 R4.1
PX_SCK_RFID  (via drill 0.3)
  Top 0.305: R3.1 56.44,33.61 Q1.2 56.5,32.3 57.1,31.7 65.4,31.7 68.7,35 68.7,63.4 69.8,64.5 v107.1,64.5 | J1.C12 139.27,61.43 v136.2,64.5 | v115.9,64.5 v126.3,64.5
  Bottom 0.305: v107.1,64.5 v115.9,64.5 | v126.3,64.5 v136.2,64.5
PX_SS  (via drill 0.3, 0.6)
  Top 0.305: Q6.3 v60.8,52.4
  Top 0.406: v105.4,48.5 106.3,48.5 107.4,47.4 107.4,45.2 106.49,44.29 IC2.44
  Bottom 0.305: R20.1 v60.8,52.4 62.7,52.4 67.3,47.8 JUM3.4
  Bottom 0.406: JUM3.4 104.71,47.81 v105.4,48.5
PX_SS_RFID  (via drill 0.3)
  Top 0.305: R19.1 56.46,51.41 Q6.2 56.5,50.6 57.1,50 63.2,50 65.3,52.1 65.3,65.6 67.8,68.1 v109.5,68.1 | J1.A12 154.7,60.4 153.1,58.8 139.3,58.8 130,68.1 v114.8,68.1
  Bottom 0.305: v109.5,68.1 v114.8,68.1
RS485_COM_ORANGE  (via drill 0.3)
  Top 0.305: IC2.30 117.67,37.63 118.3,37 v118.3,27.7 | R6.2 10.36,80.5 39,80.5 42.2,77.3 42.2,13.9 45.6,10.5 110.1,10.5 110.3,10.7 v110.3,12
  Bottom 0.305: v118.3,27.7 111.6,27.7 110.3,26.4 v110.3,12
RXD_RFID  (via drill 0.3)
  Top 0.305: R21.1 56.06,27.01 Q7.2 56.5,26.4 57.1,25.8 v63.4,25.8
  Bottom 0.305: v63.4,25.8 67.1,25.8 69.7,23.2 69.7,12.5 71.65,10.55 71.7,10.5 141.3,10.5 143.8,13 143.8,39 145.91,41.11 J1.C20
RXD_RFID_5V  (via drill 0.3)
  Top 0.305: IC3.30 101.2,85.53 JUM2.2 102.07,88.53 100.9,89.7 74.4,89.7 70.3,85.6 v70.3,69.9 | Q7.3 v62.5,28.4 68,28.4 70.3,30.7 v70.3,62
  Bottom 0.305: R22.1 v62.5,28.4 | v70.3,62 v70.3,69.9
SPI_COM_ORANGE  (via drill 0.3)
  Top 0.305: IC2.32 119.47,39.23 v120.6,38.1 | R7.2 38.4,75.4 40.7,73.1 40.7,12.3 44.4,8.6 113.6,8.6 115.6,10.6 v115.6,11.8
  Bottom 0.305: v120.6,38.1 120.6,37.3 119.4,36.1 119.4,24.3 115.6,20.5 v115.6,11.8
SPI_ON_GREEN  (via drill 0.3)
  Top 0.305: IC2.31 118.57,38.43 119.4,37.6 119.4,36.1 v120.6,34.9 | v120.6,11.9 120.6,9.4 118.2,7 42.9,7 38.2,11.7 38.2,69.3 35.9,71.6 R8.2
  Bottom 0.305: v120.6,34.9 v120.6,11.9
SYS_RS+
  Top 0.406: IC6.6 148.99,16.34 J1.C30
SYS_RS-
  Top 0.406: IC6.7 146.69,17.62 147.32,18.25 152.16,18.25 J1.A30
SYS_RX
  Top 0.305: IC6.1 135.25,18.89 134.62,18.25 107.95,18.25 105.41,20.79 105.41,30.95 106.36,31.9 106.36,33.17 105.91,33.63 IC2.9
SYS_TE
  Top 0.305: IC6.2 IC6.3 135.25,16.34 134.62,16.98 106.68,16.98 104.69,18.97 IC2.11
SYS_TX
  Top 0.305: IC6.4 135.25,15.08 134.62,15.71 104.14,15.71 102.87,16.98 102.87,32.22 103.48,32.83 IC2.10
TXD_RFID  (via drill 0.3)
  Top 0.305: R25.1 56.34,21.31 Q8.2 56.4,20.2 57.1,19.5 v62.7,19.5
  Bottom 0.305: v62.7,19.5 66.3,19.5 68,17.8 68,11.7 70.5,9.2 142,9.2 145,12.2 145,31.6 146.8,33.4 152.07,33.4 J1.A22
TXD_RFID_5V  (via drill 0.3)
  Top 0.305: IC3.31 100.4,85.53 JUM2.1 99.5,86.43 99.5,87.6 99,88.1 75.2,88.1 71.9,84.8 v71.9,69.9 | Q8.3 v62.5,22.2 67.5,22.2 71.9,26.6 v71.9,62
  Bottom 0.305: R26.1 v62.5,22.2 | v71.9,62 v71.9,69.9
UART_COM_ORANGE  (via drill 0.3)
  Top 0.305: IC3.24 v109.9,80.4 | R10.2 36.38,67.78 v36.4,67.8 | v47.5,67.8 v51.5,67.8
  Bottom 0.305: v109.9,80.4 109.9,82.1 108.9,83.1 60.1,83.1 58.7,81.7 58.7,70.1 56.4,67.8 v51.5,67.8 | v36.4,67.8 v47.5,67.8
UART_ON_GREEN  (via drill 0.3)
  Top 0.305: IC3.23 109.2,79.6 v109.8,79 | v51.6,64 v47.4,64 | v36.6,64 14.18,64 R9.2
  Bottom 0.305: v109.8,79 107.4,81.4 61.6,81.4 60,79.8 60,66.8 57.2,64 v51.6,64 | v47.4,64 v36.6,64

### Text on the board
Top: V-00493-01 / LIC_rack_CV-01 / Lukas Novak / 30.07.2015